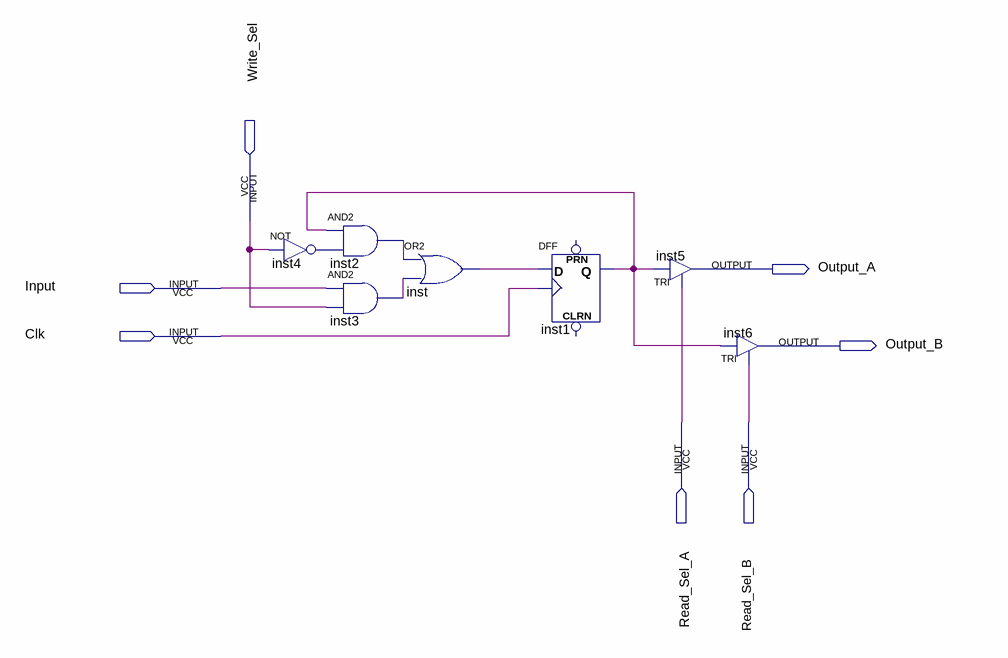
[diagram p0: schematic sheet]
// Quartus schematic register.bdf as structural Verilog: 7 symbols, 7 pins
module register (
  input  Write_Sel,
  input  Input,
  input  Clk,
  input  Read_Sel_A,
  input  Read_Sel_B,
  output Output_A,
  output Output_B
);

  wire inst1_q, inst2_out, inst3_out, inst4_out, inst_out;

  not inst4 (inst4_out, Write_Sel);
  and inst2 (inst2_out, inst1_q, inst4_out);
  and inst3 (inst3_out, Input, Write_Sel);
  or inst (inst_out, inst2_out, inst3_out);
  DFF inst1 (.CLK(Clk), .D(inst_out), .Q(inst1_q));  // open: CLRN, PRN
  TRI inst5 (.IN(inst1_q), .OE(Read_Sel_A), .OUT(Output_A));
  TRI inst6 (.IN(inst1_q), .OE(Read_Sel_B), .OUT(Output_B));
endmodule
